# Altium schematic sheet Sheet3_MCU.SchDoc: =ProjectName
size A4; DocumentNumber: 3; SheetNumber: 3; SheetTotal: 4
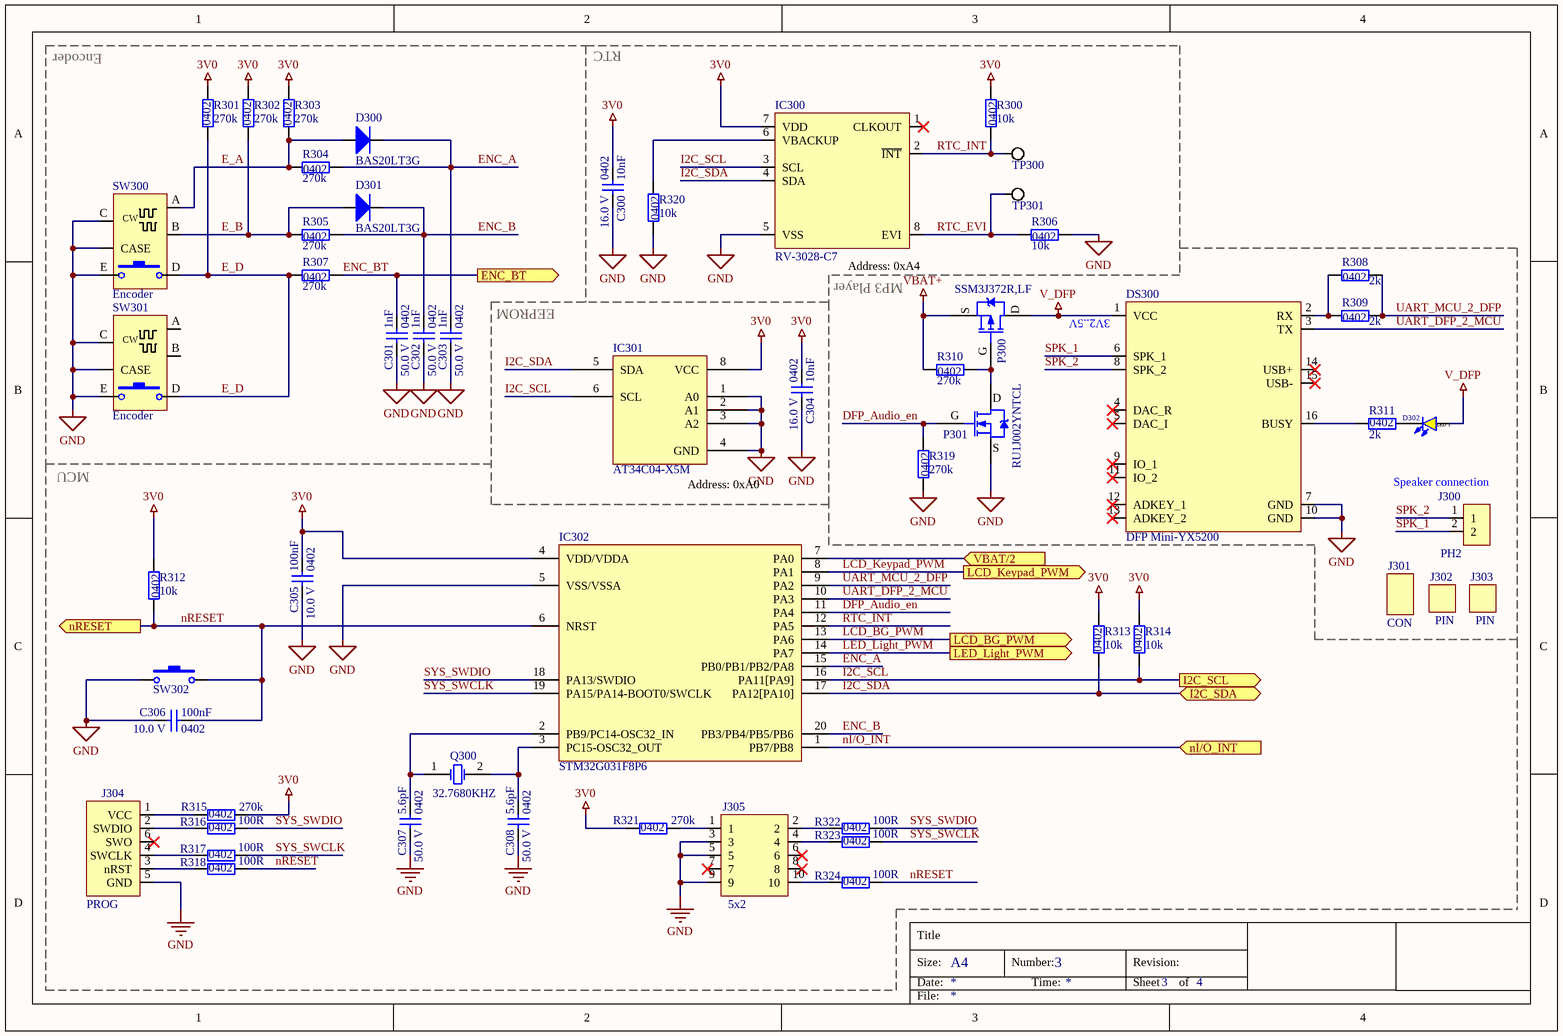
[diagram p0: Sheet3_MCU.SchDoc]

## Parts
C300  Capacitance: 10nF  Footprint: 0402  Voltage: 16.0 V  [C_0402]  (hidden comment: C 10nF 0402 16V)
C301  Capacitance: 1nF  Footprint: 0402  Voltage: 50.0 V  [C_0402]  (hidden comment: C 1nF 0402 50V)
C302  Capacitance: 1nF  Footprint: 0402  Voltage: 50.0 V  [C_0402]  (hidden comment: C 1nF 0402 50V)
C303  Capacitance: 1nF  Footprint: 0402  Voltage: 50.0 V  [C_0402]  (hidden comment: C 1nF 0402 50V)
C304  Capacitance: 10nF  Footprint: 0402  Voltage: 16.0 V  [C_0402]  (hidden comment: C 10nF 0402 16V)
C305  Capacitance: 100nF  Footprint: 0402  Voltage: 10.0 V  [C_0402]  (hidden comment: C 100nF 0402 10V)
C306  Capacitance: 100nF  Footprint: 0402  Voltage: 10.0 V  [C_0402]  (hidden comment: C 100nF 0402 10V)
C307  Capacitance: 5.6pF  Footprint: 0402  Voltage: 50.0 V  [C_0402]  (hidden comment: C 5.6pF 0402 50V)
C308  Capacitance: 5.6pF  Footprint: 0402  Voltage: 50.0 V  [C_0402]  (hidden comment: C 5.6pF 0402 50V)
D300  BAS20LT3G  [SOT-23-3]
D301  BAS20LT3G  [SOT-23-3]
D302  LED Y  [LED_0603]
DS300  DFP Mini-YX5200  [DFP_Player_Mini]
IC300  RV-3028-C7  [MC-C7]
IC301  AT34C04-X5M  [TSSOP-8_4.4mm]
IC302  STM32G031F8P6  [TSSOP-20]
J300  PH2  [J_S2B-PH-K-S]
J301  CON  (mechanical)
J302  PIN  (mechanical)
J303  PIN  (mechanical)
J304  PROG  [J_TC2030-IDC-NL]  (no BOM)
J305  5x2  [J_MH5x2_1.27-STM32]
P300  Manufacturer Part Number: SSM3J372R,LF  [SOT-23-3-F]  (hidden comment: P PMOS 30V 6A)
P301  Manufacturer Part Number: RU1J002YNTCL  [UMT3F]  (hidden comment: P_NCH_50V_150mW)
Q300  32.7680KHZ  [Q2_3.2x1.5]
R300  Resistance: 10k  Footprint: 0402  [R_0402]  (hidden comment: R 10k 0402)
R301  Resistance: 270k  Footprint: 0402  [R_0402]  (hidden comment: R 270k 0402)
R302  Resistance: 270k  Footprint: 0402  [R_0402]  (hidden comment: R 270k 0402)
R303  Resistance: 270k  Footprint: 0402  [R_0402]  (hidden comment: R 270k 0402)
R304  Resistance: 270k  Footprint: 0402  [R_0402]  (hidden comment: R 270k 0402)
R305  Resistance: 270k  Footprint: 0402  [R_0402]  (hidden comment: R 270k 0402)
R306  Resistance: 10k  Footprint: 0402  [R_0402]  (hidden comment: R 10k 0402)
R307  Resistance: 270k  Footprint: 0402  [R_0402]  (hidden comment: R 270k 0402)
R308  Resistance: 2k  Footprint: 0402  [R_0402]  (hidden comment: R 2k 0402)
R309  Resistance: 2k  Footprint: 0402  [R_0402]  (hidden comment: R 2k 0402)
R310  Resistance: 270k  Footprint: 0402  [R_0402]  (hidden comment: R 270k 0402)
R311  Resistance: 2k  Footprint: 0402  [R_0402]  (hidden comment: R 2k 0402)
R312  Resistance: 10k  Footprint: 0402  [R_0402]  (hidden comment: R 10k 0402)
R313  Resistance: 10k  Footprint: 0402  [R_0402]  (hidden comment: R 10k 0402)
R314  Resistance: 10k  Footprint: 0402  [R_0402]  (hidden comment: R 10k 0402)
R315  Resistance: 270k  Footprint: 0402  [R_0402]  (hidden comment: R 270k 0402)
R316  Resistance: 100R  Footprint: 0402  [R_0402]  (hidden comment: R 100R 0402)
R317  Resistance: 100R  Footprint: 0402  [R_0402]  (hidden comment: R 100R 0402)
R318  Resistance: 100R  Footprint: 0402  [R_0402]  (hidden comment: R 100R 0402)
R319  Resistance: 270k  Footprint: 0402  [R_0402]  (hidden comment: R 270k 0402)
R320  Resistance: 10k  Footprint: 0402  [R_0402]  (hidden comment: R 10k 0402)
R321  Resistance: 270k  Footprint: 0402  [R_0402]  (hidden comment: R 270k 0402)
R322  Resistance: 100R  Footprint: 0402  [R_0402]  (hidden comment: R 100R 0402)
R323  Resistance: 100R  Footprint: 0402  [R_0402]  (hidden comment: R 100R 0402)
R324  Resistance: 100R  Footprint: 0402  [R_0402]  (hidden comment: R 100R 0402)
SW300  Encoder  [PEC11R]
SW301  Encoder  [PEC11R]
SW302  SW  [SW_PTS810]  (value not drawn)
TP300  TP  [TP_1mm]  (value not drawn)  (net tie, no BOM)
TP301  TP  [TP_1mm]  (value not drawn)  (net tie, no BOM)

## Blocks framed on the sheet
EEPROM: C304 IC301

## Ports
ENC_BT (out), I2C_SCL (out), I2C_SDA (bidir), LCD_BG_PWM (out), LCD_Keypad_PWM (out), LED_Light_PWM (out), nI/O_INT (in), nRESET (out), VBAT/2 (in)

## Nets
3V0: C300.2 C304.2 C305.2 IC300.7(VDD) IC301.8(VCC) IC302.4(VDD/VDDA) R300.2 R301.2 R302.2 R303.2 R312.2 R313.2 R314.2 R315.2 R321.1
GND: C300.1 C301.1 C302.1 C303.1 C304.1 C305.1 C306.1 C307.1 C308.1 DS300.7(GND) DS300.10(GND) IC300.5(VSS) IC301.1(A0) IC301.2(A1) IC301.3(A2) IC301.4(GND) IC302.5(VSS/VSSA) J304.5(GND) J305.3 J305.5 J305.9 P301.2(S) R306.2 R319.2 R320.1 SW300.C SW300.CASE SW300.E SW301.C SW301.CASE SW301.E SW302.1(1,_2)
V_DFP: D302.A DS300.1(VCC) P300.3(D)
VBAT+: P300.2(S) R310.2
DFP_Audio_en: IC302.11(PA4) P301.1(G) R319.1
E_A: D300.1(A) R303.1 R304.2 SW300.A
E_B: D301.1(A) R302.1 R305.2 SW300.B
E_D: R301.1 R307.2 SW300.D SW301.D
ENC_A: C303.2 D300.3(K) IC302.15(PB0/PB1/PB2/PA8) R304.1
ENC_B: C302.2 D301.3(K) IC302.20(PB3/PB4/PB5/PB6) R305.1
ENC_BT: C301.2 R307.1 ; port ENC_BT
I2C_SCL: IC300.3(SCL) IC301.6(SCL) IC302.16(PA11[PA9]) R314.1 ; port I2C_SCL
I2C_SDA: IC300.4(SDA) IC301.5(SDA) IC302.17(PA12[PA10]) R313.1 ; port I2C_SDA
LCD_BG_PWM: IC302.13(PA6) ; port LCD_BG_PWM
LCD_Keypad_PWM: IC302.8(PA1) ; port LCD_Keypad_PWM
LED_Light_PWM: IC302.14(PA7) ; port LED_Light_PWM
nI/O_INT: IC302.1(PB7/PB8) ; port nI/O_INT
nRESET: C306.2 IC302.6(NRST) R312.1 R318.2 R324.2 SW302.3(2,_3) ; port nRESET
RTC_EVI: IC300.8(EVI) R306.1 TP301.1(TP)
RTC_INT: IC300.2(~{INT}) IC302.12(PA5) R300.1 TP300.1(TP)
SPK_1: DS300.6(SPK_1) J300.2
SPK_2: DS300.8(SPK_2) J300.1
SYS_SWCLK: IC302.19(PA15/PA14-BOOT0/SWCLK) R317.2 R323.2
SYS_SWDIO: IC302.18(PA13/SWDIO) R316.2 R322.2
UART_DFP_2_MCU: DS300.3(TX) IC302.10(PA3)
UART_MCU_2_DFP: IC302.9(PA2) R308.1 R309.1
VBAT/2: IC302.7(PA0) ; port VBAT/2
NetC307_2: C307.2 IC302.2(PB9/PC14-OSC32_IN) Q300.1(OSC1)
NetC308_2: C308.2 IC302.3(PC15-OSC32_OUT) Q300.2(OSC2)
NetD302_K: D302.K R311.2
NetDS300_2: DS300.2(RX) R308.2 R309.2
NetDS300_16: DS300.16(BUSY) R311.1
NetIC300_6: IC300.6(VBACKUP) R320.2
NetJ304_1: J304.1(VCC) R315.1
NetJ304_2: J304.2(SWDIO) R316.1
NetJ304_3: J304.3(nRST) R318.1
NetJ304_4: J304.4(SWCLK) R317.1
NetJ305_1: J305.1 R321.2
NetJ305_2: J305.2 R322.1
NetJ305_4: J305.4 R323.1
NetJ305_10: J305.10 R324.1
NetP300_1: P300.1(G) P301.3(D) R310.1

Not connected (* = marked no-connect by the designer): DS300 4(DAC_R)* 5(DAC_I)* 9(IO_1)* 11(IO_2)* 12(ADKEY_1)* 13(ADKEY_2)* 14(USB+)* 15(USB-)*; IC300 1(CLKOUT)*; J304 6(SWO)*; J305 6* 7* 8*; SW301 A B

## Notes on the sheet
- Encoder
- RTC
- (near IC300) Address: 0xA4
- (near IC300) MP3 Player
- (near DS300) 3V2..5V
- MCU
- (near IC301) Address: 0xA0
- (near J300) Speaker connection
- Title
- Size:
- Date:
- A4
- Number:
- Time:
- Revision:
- Sheet
- of
- File:
- (in symbol ENC_12_THT) CW

## Library data of the parts
C300 C304 = CAP_10nF_16V_0402: CAP CER 10000PF 16V Y5V 0402; Manufacturer: Samsung Electro-Mechanics; Manufacturer Part Number: CL05F103ZO5NNNC; Type: Capacitor; Supplier 1: Digi-Key; Supplier Part Number 1: 1276-1738-1-ND
C301-C303 = CAP_1nF_50V_0402: CAP CER 1000PF 50V C0G/NP0 0402; Manufacturer: Murata Electronics; Manufacturer Part Number: GRM1555C1H102JA01J; Type: Capacitor; Supplier 1: Digi-Key; Supplier Part Number 1: 490-6190-1-ND
C305 C306 = CAP_100nF_10V_0402: CAP CER 0.1UF 10V X5R 0402; Manufacturer: Samsung Electro-Mechanics; Manufacturer Part Number: CL05A104MP5NNNC; Type: Capacitor; Supplier 1: Digi-Key; Supplier Part Number 1: 1276-1443-1-ND
C307 C308 = CAP_5.6PF_50V_0402: CAP CER 5.6PF 50V C0G/NP0 0402; Manufacturer: Samsung Electro-Mechanics; Manufacturer Part Number: CL05C5R6DB5NNNC; Type: Capacitor; Supplier 1: Digi-Key; Supplier Part Number 1: 1276-1712-1-ND
D300 D301 = D_LL_200V_200mA: DIODE GP 200V 200MA SOT23-3; Manufacturer: onsemi; Type: Diode; Supplier 1: Digi-Key; Supplier Part Number 1: BAS20LT3GOSCT-ND; Manufacturer Part Number: BAS20LT3G
D302 = D_LED_Yellow_0603: LED YELLOW DIFFUSED; Manufacturer: Stanley Electric Co; Manufacturer Part Number: FKY1111C-TR; Type: Diode, LED; Supplier 1: Digi-Key; Supplier Part Number 1: 404-1273-1-ND
DS300 = DFP_Player_mini: Mini-YX5200 Audio MP3 Modul; Manufacturer: DFRobot; Manufacturer Part Number: DFR0299; Type: other; Supplier 1: AliExpress; Supplier Part Number 1: 33036928283
IC300 = IC_RTC_3028-C7: IC RTC CLK/CALENDAR I2C 10SON; Manufacturer: Micro Crystal AG; Manufacturer Part Number: RV-3028-C7TAQC; Type: IC, RTC; Supplier 1: Mouser; Supplier Part Number 1: 428-203591-MG01
IC301 = IC_EEPROM_AT34C04: IC EEPROM 4KBIT I2C 1MHZ 8TSSOP; Manufacturer: Microchip Technology; Manufacturer Part Number: AT34C04-X5M-T; Type: IC, EEPROM; Supplier 1: Digi-Key; Supplier Part Number 1: AT34C04-X5M-TCT-ND
IC302 = IC_MCU_STM32G031F8P6: IC MCU 32BIT 32KB FLASH 20TSSOP; Manufacturer: STMicroelectronics; Manufacturer Part Number: STM32G031F8P6; Type: IC, MCU; Supplier 1: LCSC; Supplier Part Number 1: C529334
J300 = J_S2B-PH-KL: CONN HEADER R/A 2POS 2MM; Manufacturer: JST Sales America Inc.; Manufacturer Part Number: S2B-PH-KL(LF)(SN); Pitch: 2; Type: Connector; Supplier 1: LCSC; Supplier Part Number 1: C160237; Pins: 2
J301 = J_PHR-2-R: CONN CONNECTOR PH 2POS 2MM; Manufacturer: JST Sales America Inc.; Pitch: 2; Manufacturer Part Number: PHR-2-R; Type: Connector; Supplier 1: LCSC; Supplier Part Number 1: C398543; Pins: 2
J302 J303 = J_PHR-2-R_PIN: PIN INSERT; Manufacturer: JST Sales America Inc.; Manufacturer Part Number: SPH-004T-P0.5S; Type: Connector; Supplier 1: LCSC; Supplier Part Number 1: C160351
J304 = J_TC2030-IDC-NL: SWD Programmer No Legs; Manufacturer: Tag_connect; Manufacturer Part Number: TC2030; Type: Connector; Pins: 3
J305 = J_MH5x2_1.27: CONN HEADER SMD 10POS 1.27MM; Manufacturer: Sullins Connector Solutions; Manufacturer Part Number: GRPB052VWQS-RC; Pitch: 1.27; Type: Connector; Supplier 1: Digi-Key; Supplier Part Number 1: S9012E-05-ND; Pins: 10
P300 = P_PCH_30V_1W: MOSFET P-CH 30V 6A SOT23F; Manufacturer: Toshiba Semiconductor and Storage; Type: Transistor; Supplier 1: Digi-Key; Supplier Part Number 1: SSM3J372RLFCT-ND
P301 = P_NCH_50V_150mW: MOSFET N-CH 50V 200MA UMT3F; Manufacturer: Rohm Semiconductor; Type: Transistor; Supplier 1: Digi-Key; Supplier Part Number 1: RU1J002YNTCLCT-ND
Q300 = Q_32k768_12p5: CRYSTAL 32.7680KHZ 12.5PF SMD; Manufacturer: NDK America, Inc.; Manufacturer Part Number: NX3215SA-32.768K-EXS00A-MU00003; Type: Other, Crystal; Supplier 1: Digi-Key; Supplier Part Number 1: 644-1313-1-ND
R300 R306 R312-R314 R320 = R_10k_0402: RES 10K OHM 1% 1/16W 0402; Manufacturer: YAGEO; Manufacturer Part Number: RC0402FR-0710KL; Type: Resistor; Supplier 1: Digi-Key; Supplier Part Number 1: 311-10.0KLRCT-ND
R301-R305 R307 R310 R315 R319 R321 = R_270k_0402: RES 270K OHM 1% 1/16W 0402; Manufacturer: YAGEO; Manufacturer Part Number: RC0402FR-07270KL; Type: Resistor; Supplier 1: Digi-Key; Supplier Part Number 1: 311-270KLRCT-ND
R308 R309 R311 = R_2k_0402: RES 2K OHM 1% 1/16W 0402; Manufacturer: Stackpole Electronics Inc; Manufacturer Part Number: RMCF0402FT2K00; Type: Resistor; Supplier 1: Digi-Key; Supplier Part Number 1: RMCF0402FT2K00CT-ND
R316-R318 R322-R324 = R_100R_0402: RES 100 OHM 1% 1/16W 0402; Manufacturer: Stackpole Electronics Inc; Manufacturer Part Number: RMCF0402FT100R; Type: Resistor; Supplier 1: Digi-Key; Supplier Part Number 1: RMCF0402FT100RCT-ND
SW300 SW301 = ENC_12_THT: ROTARY ENCODER MECHANICAL 12PPR; Manufacturer: Bourns Inc.; Manufacturer Part Number: PEC11R-4220F-S0012; Supplier 1: Digi-Key; Supplier Part Number 1: PEC11R-4220F-S0012-ND; Type: other, Encoder
SW302 = SW_TactileSW_V: SWITCH TACTILE SPST-NO 0.05A 16V; Manufacturer: C&K; Manufacturer Part Number: PTS810 SJM 250 SMTR LFS; Type: other; Supplier 1: Digi-Key; Supplier Part Number 1: CKN10502CT-ND
TP300 TP301 = TP_1mm: Test Point 1mm